# Altium schematic sheet power.SchDoc
size Letter
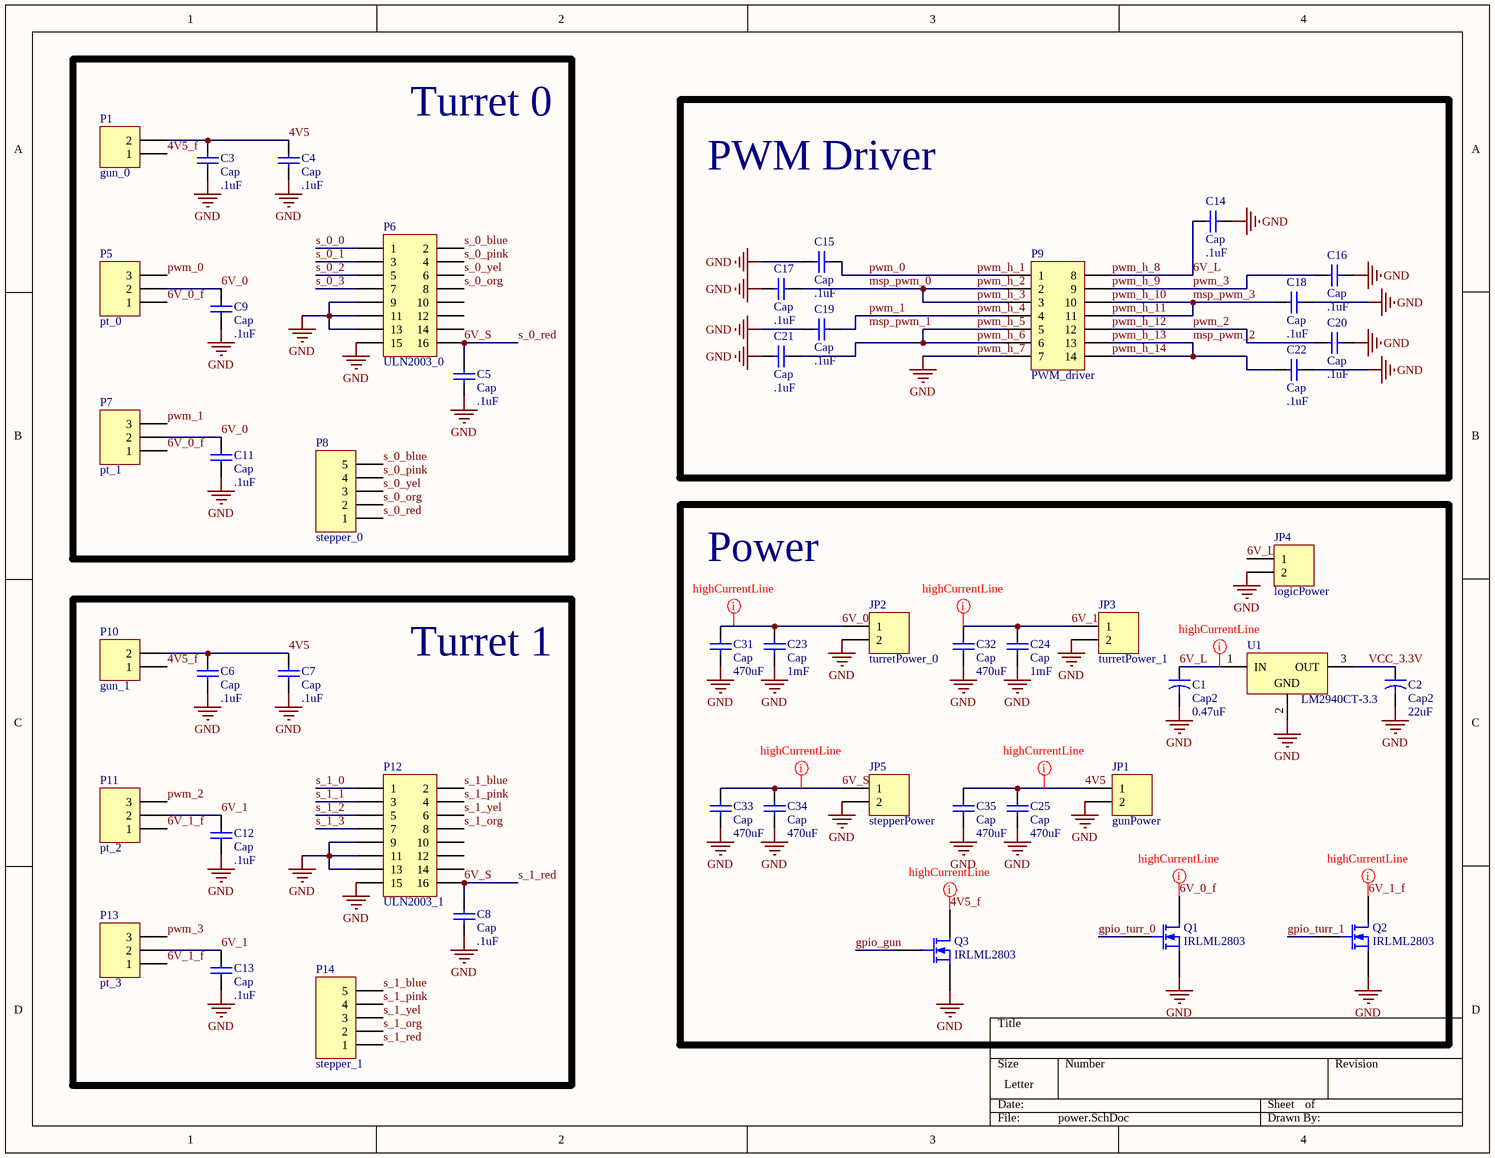
[diagram p0: power.SchDoc]

## Parts
C1  Cap2  value 0.47uF  [RAD-0.1]
C2  Cap2  value 22uF  [RAD-0.1]
C3  Cap  value .1uF  [RAD-0.1]
C4  Cap  value .1uF  [RAD-0.1]
C5  Cap  value .1uF  [RAD-0.1]
C6  Cap  value .1uF  [RAD-0.1]
C7  Cap  value .1uF  [RAD-0.1]
C8  Cap  value .1uF  [RAD-0.1]
C9  Cap  value .1uF  [RAD-0.1]
C11  Cap  value .1uF  [RAD-0.1]
C12  Cap  value .1uF  [RAD-0.1]
C13  Cap  value .1uF  [RAD-0.1]
C14  Cap  value .1uF  [RAD-0.1]
C15  Cap  value .1uF  [RAD-0.1]
C16  Cap  value .1uF  [RAD-0.1]
C17  Cap  value .1uF  [RAD-0.1]
C18  Cap  value .1uF  [RAD-0.1]
C19  Cap  value .1uF  [RAD-0.1]
C20  Cap  value .1uF  [RAD-0.1]
C21  Cap  value .1uF  [RAD-0.1]
C22  Cap  value .1uF  [RAD-0.1]
C23  Cap  value 1mF  [RAD-0.1]
C24  Cap  value 1mF  [RAD-0.1]
C25  Cap  value 470uF  [RAD-0.1]
C31  Cap  value 470uF  [RAD-0.1]
C32  Cap  value 470uF  [RAD-0.1]
C33  Cap  value 470uF  [RAD-0.1]
C34  Cap  value 470uF  [RAD-0.1]
C35  Cap  value 470uF  [RAD-0.1]
JP1  gunPower  [CON2screw]
JP2  turretPower_0  [CON2screw]
JP3  turretPower_1  [CON2screw]
JP4  logicPower  [CON2screw]
JP5  stepperPower  [CON2screw]
P1  gun_0  [HDR1X2]
P5  pt_0  [HDR1X3]
P6  ULN2003_0  [DIP-16]
P7  pt_1  [HDR1X3]
P8  stepper_0  [HDR1X5]
P9  PWM_driver  [DIP-14]
P10  gun_1  [HDR1X2]
P11  pt_2  [HDR1X3]
P12  ULN2003_1  [DIP-16]
P13  pt_3  [HDR1X3]
P14  stepper_1  [HDR1X5]
Q1  IRLML2803  [SO-G3]
Q2  IRLML2803  [SO-G3]
Q3  IRLML2803  [SO-G3]
U1  LM2940CT-3.3  [T03B]

## Blocks framed on the sheet
Turret 0: C3-C5 C9 C11 P1 P5-P8
PWM Driver: C14-C22 P9
Power: C1 C2 C23-C25 C31-C35 JP1-JP5 Q1-Q3 U1
Turret 1: C6-C8 C12 C13 P10-P14

## Nets
pwm_h_7: C1.2 C2.2 C3.1 C4.2 C5.1 C6.1 C7.2 C8.1 C9.1 C11.1 C12.1 C13.1 C14.1 C15.2 C16.1 C17.2 C18.1 C19.2 C20.1 C21.2 C22.1 C23.1 C24.1 C25.1 C31.1 C32.1 C33.1 C34.1 C35.1 JP1.2 JP2.2 JP3.2 JP4.2 JP5.2 P6.9 P6.11 P6.13 P6.15 P9.7 P12.9 P12.11 P12.13 P12.15 Q1.2(S) Q2.2(S) Q3.2(S) U1.2(GND)  [also labelled GND]
4V5: C3.2 C4.1 C6.2 C7.1 C25.2 C35.2 JP1.1 P1.2 P10.2
4V5_f: P1.1 P10.1 Q3.3(D)
6V_0: C9.2 C11.2 C23.2 C31.2 JP2.1 P5.2 P7.2
6V_0_f: P5.1 P7.1 Q1.3(D)
6V_1: C12.2 C13.2 C24.2 C32.2 JP3.1 P11.2 P13.2
6V_1_f: P11.1 P13.1 Q2.3(D)
6V_L: C1.1 C14.2 JP4.1 P9.8 U1.1(IN)  [also labelled pwm_h_8]
6V_S: C5.2 C8.2 C33.2 C34.2 JP5.1 P6.16 P8.1 P12.16 P14.1  [also labelled s_0_red, s_1_red]
gpio_gun: Q3.1(G)
gpio_turr_0: Q1.1(G)
gpio_turr_1: Q2.1(G)
msp_pwm_0: C17.1 P9.2 P9.3  [also labelled pwm_h_2, pwm_h_3]
msp_pwm_2: C22.2 P9.13 P9.14  [also labelled pwm_h_13, pwm_h_14]
msp_pwm_3: C18.2 P9.10 P9.11  [also labelled pwm_h_10, pwm_h_11]
pwm_0: C15.1 P5.3 P9.1  [also labelled pwm_h_1]
pwm_1: C19.1 P7.3 P9.4  [also labelled pwm_h_4]
pwm_2: C20.2 P9.12 P11.3  [also labelled pwm_h_12]
pwm_3: C16.2 P9.9 P13.3  [also labelled pwm_h_9]
pwm_h_5: C21.1 P9.5 P9.6  [also labelled pwm_h_6]
s_0_0: P6.1
s_0_1: P6.3
s_0_2: P6.5
s_0_3: P6.7
s_0_blue: P6.2 P8.5
s_0_org: P6.8 P8.2
s_0_pink: P6.4 P8.4
s_0_yel: P6.6 P8.3
s_1_0: P12.1
s_1_1: P12.3
s_1_2: P12.5
s_1_3: P12.7
s_1_blue: P12.2 P14.5
s_1_org: P12.8 P14.2
s_1_pink: P12.4 P14.4
s_1_yel: P12.6 P14.3
VCC_3.3V: C2.1 U1.3(OUT)

Not connected (* = marked no-connect by the designer): P6 10 12 14; P12 10 12 14

## Layout directives
rule Width Constraint [Pref Width = 50mil    Min Width = 50mil    Max Width = 50mil]: 4V5, 4V5_f, 6V_0, 6V_0_f, 6V_1, 6V_1_f, 6V_L, 6V_S

## Notes on the sheet
- Labels drawn without touching a wire or pin: msp_pwm_1

## Library data of the parts
C1 C2 = Cap2: Capacitor; Published: 23-Sep-2002; PackageReference: CAPR5-4X5; Publisher: Altium Limited; PackageDescription: Capacitor; 2 Leads
C3-C9 C11-C25 C31-C35 = Cap: Capacitor; Published: 8-Jun-2000; LatestRevisionDate: 17-Jul-2002; LatestRevisionNote: Re-released for DXP Platform.; PackageReference: RAD-0.3; Publisher: Altium Limited; PackageDescription: Radial Cap, Thru-Hole; 2 Leads; 0.3 in Pin Spacing
JP1-JP5 = Power
P1 P10 = Header 2: Header, 2-Pin; LatestRevisionDate: 17-Jul-2002; LatestRevisionNote: Re-released for DXP Platform.; Publisher: Altium Limited
P5 P7 P11 P13 = Header 3: Header, 3-Pin; LatestRevisionDate: 17-Jul-2002; LatestRevisionNote: Re-released for DXP Platform.; Publisher: Altium Limited
P6 P12 = Header 8X2: Header, 8-Pin, Dual row; LatestRevisionDate: 17-Jul-2002; LatestRevisionNote: Re-released for DXP Platform.; Publisher: Altium Limited
P8 P14 = Header 5: Header, 5-Pin; LatestRevisionDate: 17-Jul-2002; LatestRevisionNote: Re-released for DXP Platform.; Publisher: Altium Limited
P9 = Header 7X2A: Header, 7-Pin, Dual row; LatestRevisionDate: 17-Jul-2002; LatestRevisionNote: Re-released for DXP Platform.; Publisher: Altium Limited
Q1-Q3 = MOSFET-N: N-Channel MOSFET; Published: 8-Jun-2000; Revision: July-2002: Re-released for DXP Platform.; Publisher: Altium Limited
U1 = LM2940CT-5.0: 1A Low Dropout Regulator, 3-pin TO-220; Manufacturer: National Semiconductor; PackageTopMarking: NSUZXYTTE#*LM2940CT*-5.0 P+; PowerWise: N; CompType: LDO IC; High-Reliability: Y; DatasheetVersion: Jan-2007; PackageVersion: revL, Jan-1992; PackageReference: T03B; PackageDescription: TO-220, Molded, 3 Lead, Straight; PartNumber: LM2940CT-3.3; RoHS: N; PinCount: 3; ComponentLink1Description: Manufacturer URL; ComponentLink1URL: http://www.national.com/; ComponentLink2Description: LM2940C Datasheet; ComponentLink2URL: http://www.national.com/ds/LM/LM2940C.pdf; ComponentLink3Description: LM2940C Web Page; ComponentLink3URL: http://www.national.com/pf/LM/LM2940C.html; ComponentLink4Description: T03B Package Page; ComponentLink4URL: http://www.national.com/packaging/folders/t03b.html